# Altium project Kripton.PrjPcb
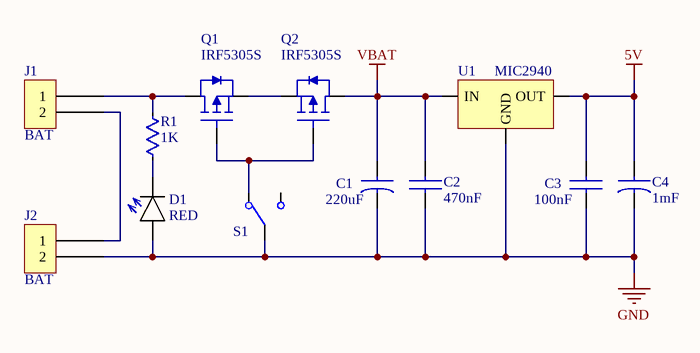
[diagram p0: PCB.SchDoc]
1 sheet, 12 parts. Net scope: global (net labels, ports and power ports of the same name join across sheets).
Board file: PCB1.PcbDoc

## Sheet PCB.SchDoc
size A4

### Parts
C1  value 220uF  [CAP-ELEC-5x11x2mm]  (hidden comment: CAP-ELEC)
C2  value 470nF  [C1206]  (hidden comment: CAP-CER)
C3  value 100nF  [C1206]  (hidden comment: CAP-CER)
C4  value 1mF  [CAP-ELEC-5x11x2mm]  (hidden comment: CAP-ELEC)
D1  RED  [LED-3MM-RED]
J1  BAT  [HEADER 1x2]
J2  BAT  [HEADER 1x2]
Q1  IRF5305S  [TO-263]
Q2  IRF5305S  [TO-263]
R1  value 1K  [R1206]  (hidden comment: RES)
S1  SLIDE-SWITCH  [SWITCH]  (value not drawn)
U1  MIC2940  [TO-263]

### Nets
5V: C3.2 C4.1 U1.3(OUT)
GND: C1.2 C2.1 C3.1 C4.2 D1.A J2.2 S1.2 U1.2(GND)
VBAT: C1.1 C2.2 Q2.D U1.1(IN)
NetD1_K: D1.K R1.1
NetJ1_1: J1.1 Q1.D R1.2
NetJ1_2: J1.2 J2.1
NetQ1_G: Q1.G Q2.G S1.1
NetQ1_S: Q1.S Q2.S

Not connected (* = marked no-connect by the designer): S1 3

### Library data of the parts
D1 = LED
J1 J2 = Header 1x2
Q1 Q2 = P-MOSFET: pin to pad: D>2 G>1 S>3
U1 = LM2940